# EAGLE design fan (EAGLE 5.12)
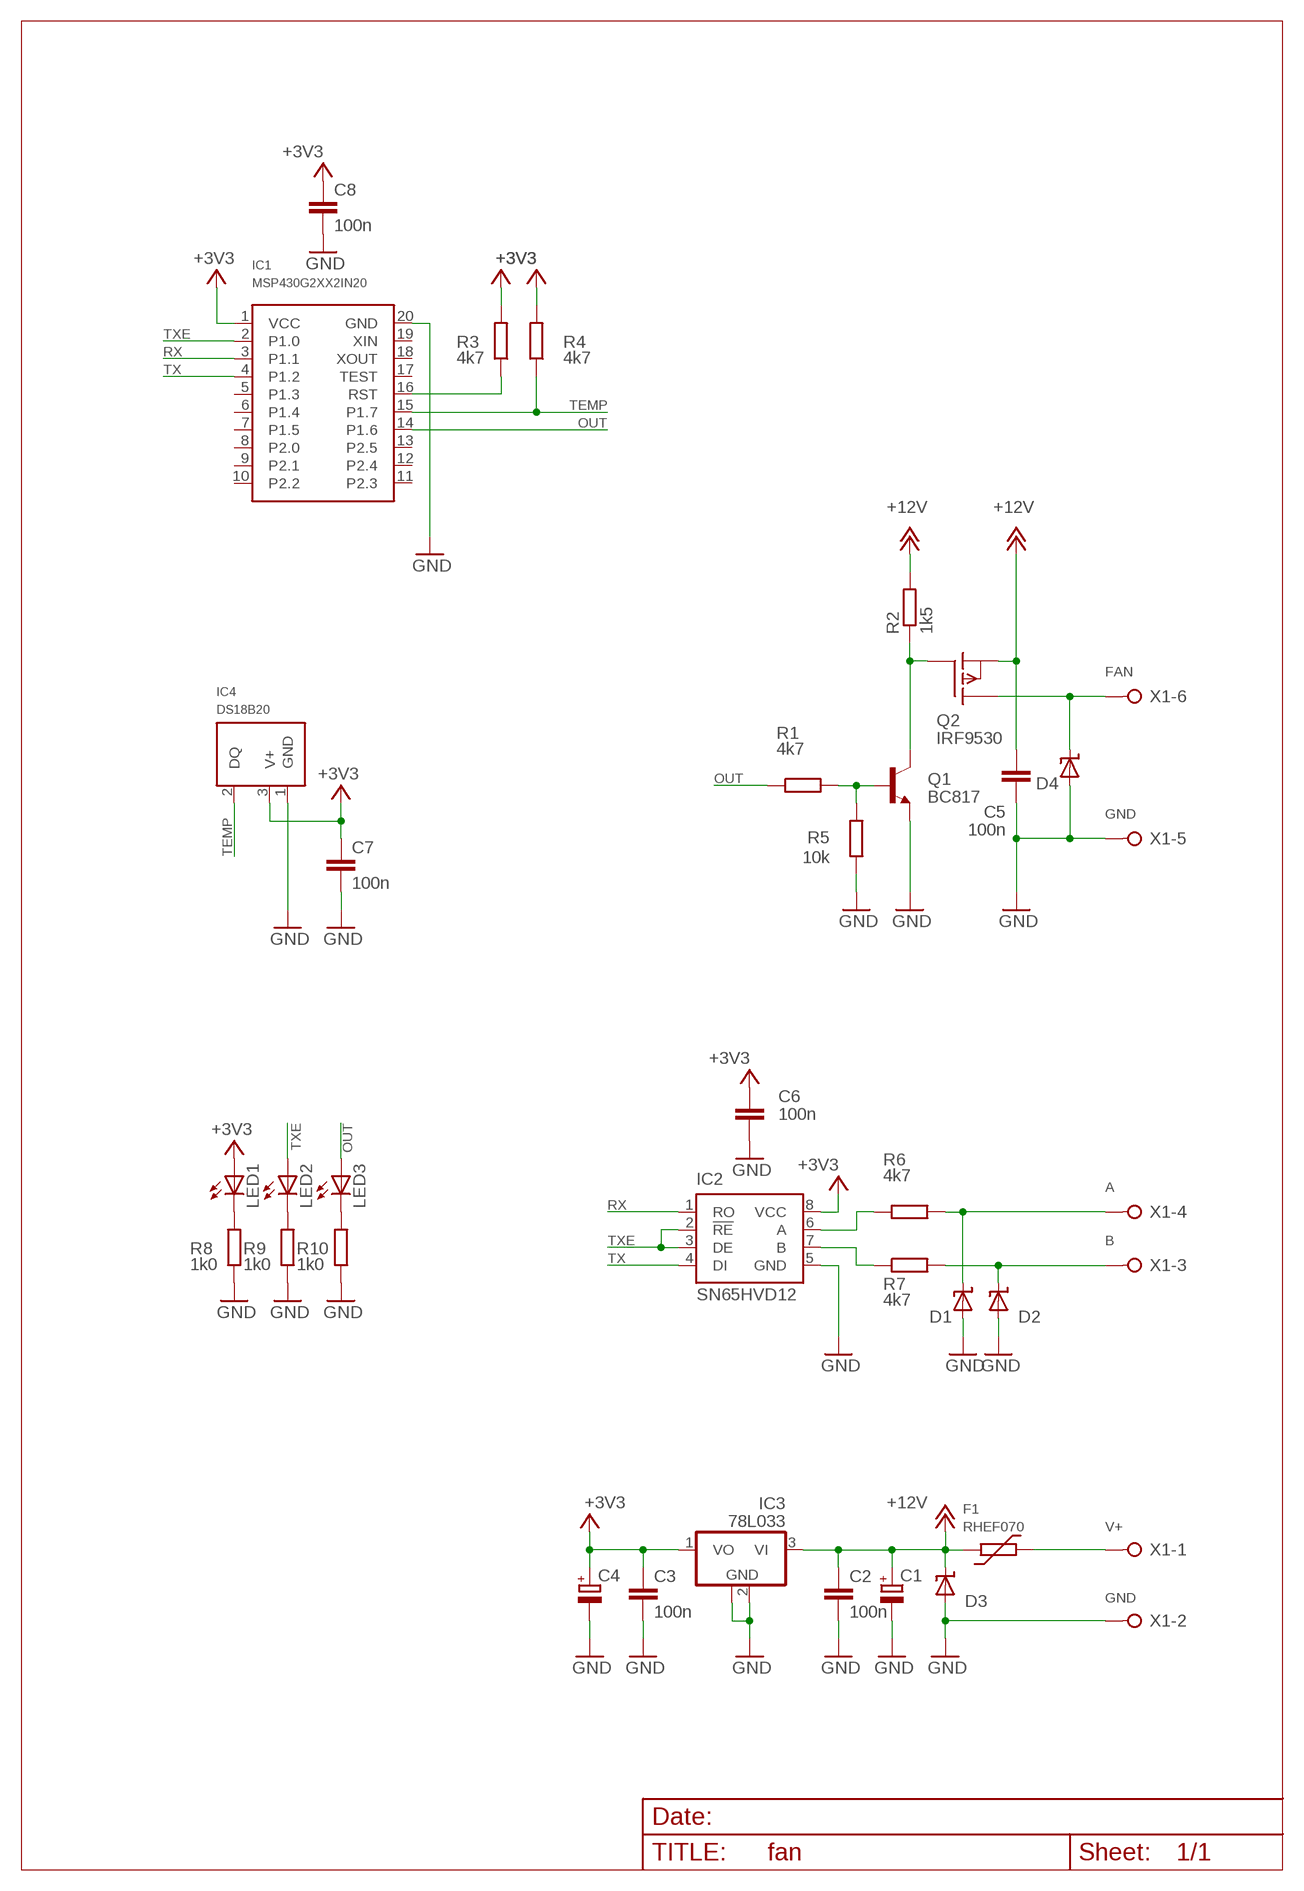
[diagram p0: schematic, sheet 1]

## Parts
C1  CPOL-EUE3.5-8  [E3,5-8]
C2  100n  C-EUC0805  [C0805]
C3  100n  C-EUC0805  [C0805]
C4  CPOL-EUE2.5-7  [E2,5-7]
C5  100n  C-EUC0805  [C0805]
C6  100n  C-EUC0805  [C0805]
C7  100n  C-EUC0805  [C0805]
C8  100n  C-EUC0805  [C0805]
D1  SUPPRESSOR-SMBJ  [SMBJ]
D2  SUPPRESSOR-SMBJ  [SMBJ]
D3  SUPPRESSOR-SMBJ  [SMBJ]
D4  SUPPRESSOR-SMBJ  [SMBJ]
F1  RHEF070  [P7]
IC1  MSP430G2XX2IN20  [DIL20]
IC2  SN65HVD12  LTC485S  [SOIC8]
IC3  78L033  78L05F  [SOT89]
IC4  DS18B20  [TO92]
LED1  LEDSML0805  [SML0805]
LED2  LEDSML0805  [SML0805]
LED3  LEDSML0805  [SML0805]
Q1  BC817  BC817-16LT1SMD  [SOT23-BEC]
Q2  IRF9530  [TO220]
R1  4k7  R-EU_M0805  [M0805]
R2  1k5  R-EU_M0805  [M0805]
R3  4k7  R-EU_M0805  [M0805]
R4  4k7  R-EU_M0805  [M0805]
R5  10k  R-EU_M0805  [M0805]
R6  4k7  R-EU_M1206  [M1206]
R7  4k7  R-EU_M1206  [M1206]
R8  1k0  R-EU_M0805  [M0805]
R9  1k0  R-EU_M0805  [M0805]
R10  1k0  R-EU_M0805  [M0805]
X1  W237-06P  [W237-6P]

## Nets
+3V3: C3.1 C4.+ C6.1 C7.1 C8.1 IC1.1(VCC) IC2.8(VCC) IC3.1(VO) IC4.3(V+) LED1.A R3.2 R4.2
+12V: C1.+ C2.1 C5.1 D3.C F1.P$1 IC3.3(VI) Q2.3(S) R2.2
A: D1.C R6.2 X1.4
B: D2.C R7.2 X1.3
FAN: D4.C Q2.2(D) X1.6
GND: C1.- C2.2 C3.2 C4.- C5.2 C6.2 C7.2 C8.2 D1.A D2.A D3.A D4.A IC1.20(GND) IC2.5(GND) IC3.2(GND) IC3.2@1(GND) IC4.1(GND) Q1.E R5.1 R8.1 R9.1 R10.1 X1.2 X1.5
N$1: Q1.C Q2.1(G) R2.1
N$2: IC1.16(RST) R3.1
N$3: Q1.B R1.2 R5.2
N$4: IC2.6(A) R6.1
N$5: IC2.7(B) R7.1
N$7: LED1.C R8.2
N$8: LED2.C R9.2
N$9: LED3.C R10.2
OUT: IC1.14(P1.6) LED3.A R1.1
RX: IC1.3(P1.1) IC2.1(RO)
TEMP: IC1.15(P1.7) IC4.2(DQ) R4.1
TX: IC1.4(P1.2) IC2.4(DI)
TXE: IC1.2(P1.0) IC2.2(!RE) IC2.3(DE) LED2.A
V+: F1.P$2 X1.1
Unconnected: IC1.5(P1.3) IC1.6(P1.4) IC1.7(P1.5) IC1.8(P2.0) IC1.9(P2.1) IC1.10(P2.2) IC1.11(P2.3) IC1.12(P2.4) IC1.13(P2.5) IC1.17(TEST) IC1.18(XOUT) IC1.19(XIN)

## Library data of the parts
C1 C4 = rcl:CPOL-EU: POLARIZED CAPACITOR, European symbol
C2 C3 C5-C8 = rcl:C-EU: CAPACITOR, European symbol
D1-D4 = MYdiode:SUPPRESSOR-: Suppressor diode
F1 = polyswitch:RHEF070
IC1 = MYtexas:MSP430G2XX2IN20
IC2 = linear-technology:LTC485: Low Power RS485 Interface Transceiver Source: http://www.linear.com/pc/downloadDocument.do?navId=H0,C1,C1007,C1017,P2064,D1718; OC_FARNELL: unknown; OC_NEWARK: unknown
IC3 = MYlinear:78L*: POSITOIV-VOLTAGE REGULATORS Output up to 100 mA Source: http://focus.ti.com/lit/ds/symlink/ua78l05.pdf
IC4 = dallas:DS18B20
LED1-LED3 = led:LED: LED OSRAM: - CHIPLED LG R971, LG N971, LY N971, LG Q971, LY Q971, LO R971, LY R971 LH N974, LH R974 LS Q976, LO Q976, LY Q976 LO Q996 - Hyper CHIPLED LW Q18S LB Q993, LB Q99A, LB R99A - SideLED LS A670, LO A670, LY A670, LG A670, LP A670 LB A673, LV A673, LT A673, LW A673 LH A674 LY A675 LS A676, LA A676, LO A676, LY A676, LW A676 LS A679, LY A679, LG A679 - Hyper Micro SIDELED® LS Y876, LA Y876, LO Y876, LY Y876 LT Y87S - SmartLED LW L88C, LW L88S LB L89C, LB L89S, LG L890 LS L89K, LO L89K, LY L89K LS L896, LA L896, LO L896, LY L896 - TOPLED LS T670, LO T670, LY T670, LG T670, LP T670 LSG T670, LSP T670, LSY T670, LOP T670, LYG T670 LG T671, LOG T671, LSG T671 LB T673, LV T673, LT T673, LW T673 LH T674 LS T676, LA T676, LO T676, LY T676, LB T676, LH T676, LSB T676, LW T676 LB T67C, LV T67C, LT T67C, LS T67K, LO T67K, LY T67K, LW E67C LS E67B, LA E67B, LO E67B, LY E67B, LB E67C, LV E67C, LT E67C LW T67C LS T679, LY T679, LG T679 LS T770, LO T770, LY T770, LG T770, LP T770 LB T773, LV T773, LT T773, LW T773 LH T774 LS E675, LA E675, LY E675, LS T675 LS T776, LA T776, LO T776, LY T776, LB T776 LHGB T686 LT T68C, LB T68C - Hyper Mini TOPLED® LB M676 - Mini TOPLED Santana® LG M470 LS M47K, LO M47K, LY M47K Source: http://www.osram.convergy.de LUXEON: - LUMILED® LXK2-PW12-R00, LXK2-PW12-S00, LXK2-PW14-U00, LXK2-PW14-V00 LXK2-PM12-R00, LXK2-PM12-S00, LXK2-PM14-U00 LXK2-PE12-Q00, LXK2-PE12-R00, LXK2-PE12-S00, LXK2-PE14-T00, LXK2-PE14-U00 LXK2-PB12-K00, LXK2-PB12-L00, LXK2-PB12-M00, LXK2-PB14-N00, LXK2-PB14-P00, LXK2-PB14-Q00 LXK2-PR12-L00, LXK2-PR12-M00, LXK2-PR14-Q00, LXK2-PR14-R00 LXK2-PD12-Q00, LXK2-PD12-R00, LXK2-PD12-S00 LXK2-PH12-R00, LXK2-PH12-S00 LXK2-PL12-P00, LXK2-PL12-Q00, LXK2-PL12-R00 Source: www.luxeon.com KINGBRIGHT: KA-3528ASYC Source: www.kingbright.com
Q1 = transistor-npn:BC817*: NPN Transistor
Q2 = transistor-fet:IRF9530: P-Channel Enhancement MOSFET (HEXFET); -100V; -12A; 0,3Ohm
R1-R10 = rcl:R-EU_: RESISTOR, European symbol
X1 = con-wago-508:W237-06P: WAGO SREW CLAMP; OC_FARNELL: unknown; OC_NEWARK: unknown

## Board
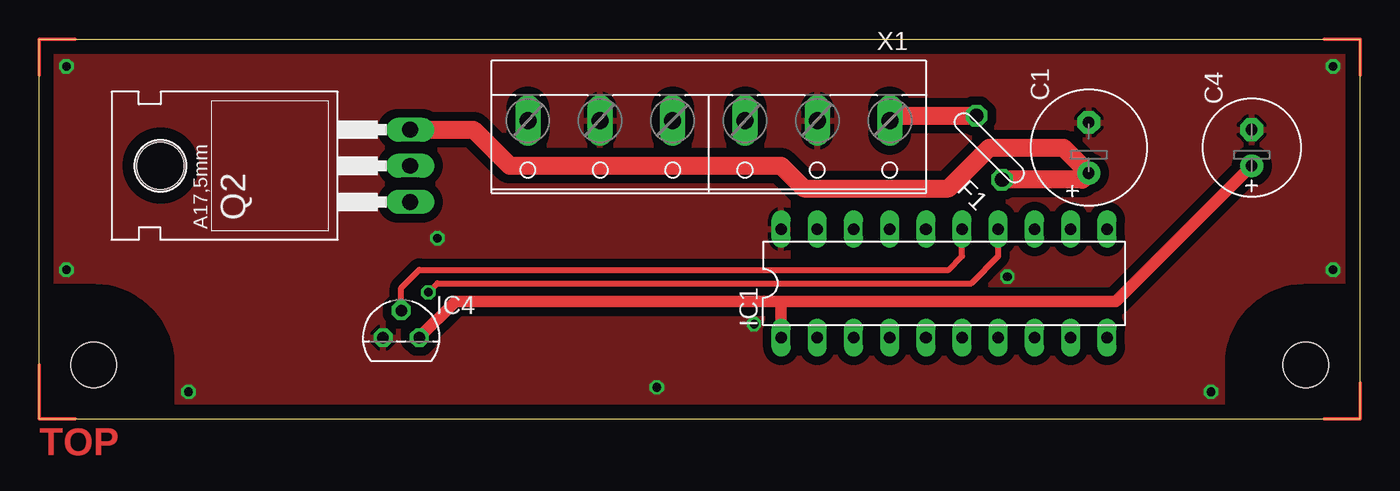
[diagram p1: board, top side]
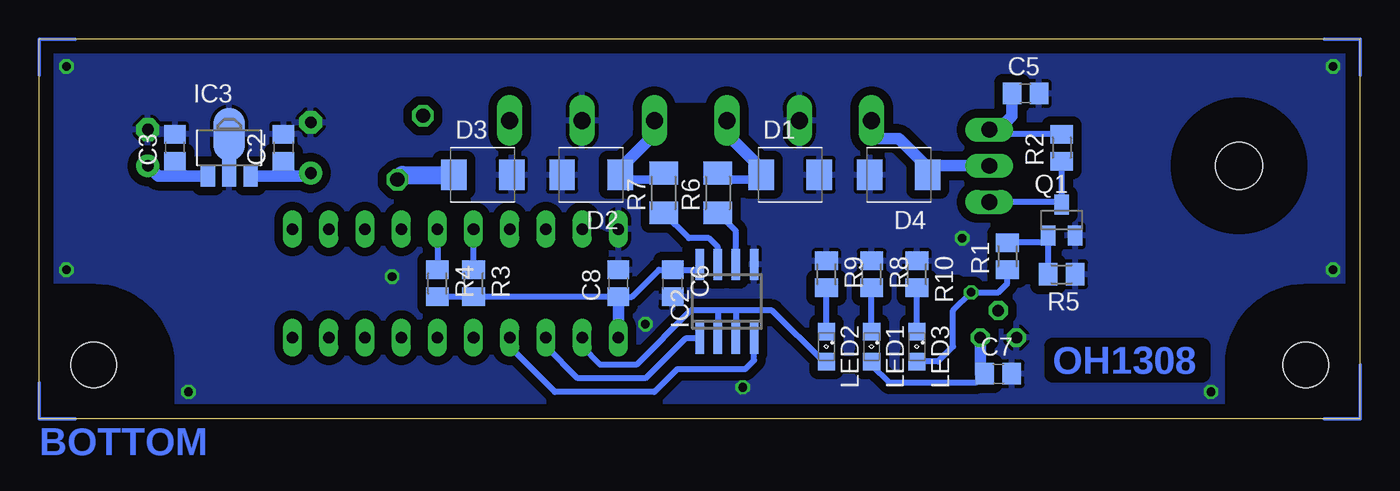
[diagram p2: board, bottom side, seen from below]

Size 92.71 x 26.67 mm. Coordinates in mm from the lower left corner, seen from the top.
Outline: 0,0 92.71,0 92.71,26.67 0,26.67 0,0
Copper layers (1*16): Top 0.035mm / dielectric 1.5mm / Bottom 0.035mm
Design rules "default *": minimum track width 10mil, minimum drill 24mil, track to track 8mil, track to pad 8mil, pad to pad 8mil, via to via 8mil, smd to smd 8mil, copper to edge 40mil, drill to drill 8mil, minimum pad ring 10mil, minimum via ring 8mil, stop-mask expansion 4mil, vias tented up to drill 25mil, thermal gap 10mil
Holes 3.2 mm at 3.81,3.81 88.9,3.81
tRestrict: 7 lines
bRestrict: area 11.1,3.2 to 21.6,5.1; 10 lines

### Footprints (pad centres in the part's own frame; a part is rotated, then mirrored left to right if it is on the bottom)
E3,5-8 = drill 0.813 pad 1.6 round: + -1.778,0 | drill 0.813 pad 1.6 octagon: - 1.778,0
C0805 = smd 1.3 x 1.5: 1 -0.95,0; 2 0.95,0
E2,5-7 = drill 0.813 pad 1.6 round: + -1.27,0 | drill 0.813 pad 1.6 octagon: - 1.27,0
SMBJ = smd 1.78 x 2.16: A 2.04,0; C -2.03,0
P7 = drill 1 octagon: P$1 -2.223,0.953; P$2 2.223,-0.953
DIL20 = drill 0.813 long: 1 -11.43,-3.81; 2 -8.89,-3.81; 3 -6.35,-3.81; 4 -3.81,-3.81; 5 -1.27,-3.81; 6 1.27,-3.81; 7 3.81,-3.81; 8 6.35,-3.81; 9 8.89,-3.81; 10 11.43,-3.81; 11 11.43,3.81; 12 8.89,3.81; 13 6.35,3.81; 14 3.81,3.81; 15 1.27,3.81; 16 -1.27,3.81; 17 -3.81,3.81; 18 -6.35,3.81; 19 -8.89,3.81; 20 -11.43,3.81
SOIC8 = smd 0.6 x 2.2: 1 -1.905,-2.6; 2 -0.635,-2.6; 3 0.635,-2.6; 4 1.905,-2.6; 5 1.905,2.6; 6 0.635,2.6; 7 -0.635,2.6; 8 -1.905,2.6
SOT89 = smd 1 x 1.5: 1 -1.499,-1.981; 3 1.499,-1.981 | smd 1 x 2: 2 0,-1.727 | smd 2.2 x 3.7: 2@1 0,0.94
TO92 = drill 0.813 octagon: 1 -1.27,0; 2 0,1.905; 3 1.27,0
SML0805 = smd 1.2 x 1.2: A 1.05,0; C -1.05,0
SOT23-BEC = smd 1 x 1.4: B -0.95,-1.1; C 0,1.1; E 0.95,-1.1
TO220 = drill 1.118 long: 1 -2.54,-6.35; 2 0,-6.35; 3 2.54,-6.35 | hole 3.302: 0,11.176
M0805 = smd 1.3 x 1.6: 1 -0.95,0; 2 0.95,0
M1206 = smd 1.6 x 2: 1 -1.4,0; 2 1.4,0
W237-6P = drill 1.194 long: 1 -12.7,-0.635; 2 -7.62,-0.635; 3 -2.54,-0.635; 4 2.54,-0.635; 5 7.62,-0.635; 6 12.7,-0.635

### Placement (x,y rotation side)
C1  73.66,19.05 90 top
C2  75.56,19.05 90 bottom
C3  83.19,19.05 90 bottom
C4  85.09,19.05 90 top
C5  23.5,22.86 0 bottom
C6  48.26,9.53 270 bottom
C7  25.4,3.17 0 bottom
C8  52.07,9.53 90 bottom
D1  40.01,17.14 0 bottom
D2  53.98,17.14 180 bottom
D3  61.59,17.14 0 bottom
D4  32.38,17.14 180 bottom
F1  66.67,19.05 135 top
IC1  63.5,9.53 0 top
IC2  44.45,8.26 0 bottom
IC3  79.38,19.05 0 bottom
IC4  25.4,5.71 0 top
LED1  34.29,5.08 270 bottom
LED2  37.47,5.08 270 bottom
LED3  31.11,5.08 270 bottom
Q1  20.95,13.97 0 bottom
Q2  19.68,17.78 90 top
R1  24.77,11.43 90 bottom
R2  20.95,19.05 90 bottom
R3  62.23,9.53 270 bottom
R4  64.77,9.53 270 bottom
R5  20.95,10.16 180 bottom
R6  45.09,15.88 90 bottom
R7  48.9,15.88 90 bottom
R8  34.29,10.16 270 bottom
R9  37.47,10.16 270 bottom
R10  31.11,10.16 270 bottom
X1  46.99,20.32 180 top

### Tracks (layer width: path | path; a pad name or v marks a point on that pad's centre or on a via)
+3V3
  Top 0.813: C4.+ 75.56,8.26 52.07,8.26 | 52.07,8.26 IC1.1 | IC4.3 29.21,8.26 52.07,8.26
  Bottom 0.406: IC2.8 46.42,10.47 C6.1 49.22,10.47 51.12,8.57 C8.1 R3.2 R4.2 | LED1.A 34.29,3.81 33.02,2.54 26.98,2.54 C7.1
  Bottom 0.813: C7.1 26.67,3.17 IC4.3 | IC1.1 C8.1 | 82.55,17.07 84.38,17.07 C4.+ | 82.55,17.07 IC3.1 | C3.1 83.19,17.7 82.55,17.07
+12V
  Top 1.27: Q2.3 30.48,20.32 33.02,17.78 52.07,17.78 53.66,16.19 63.82,16.19 66.67,19.05 71.88,19.05 C1.+ 73.19,16.8 F1.P$1
  Bottom 0.406: R2.2 25.71,20 Q2.3
  Bottom 0.813: C5.1 24.45,21.27 25.4,20.32 Q2.3 | 74.93,17.07 73.86,17.07 C1.+ | 74.93,17.07 IC3.3 | C2.1 75.56,17.7 74.93,17.07
  Bottom 1.27: D3.C 67.23,17.14 F1.P$1
A
  Bottom 0.61: R6.2 44.32,16.83 42.03,16.83 D1.C
  Bottom 0.813: X1.4 44.45,20 42.23,17.78 41.91,17.78 D1.C
B
  Bottom 0.61: R7.2 48.9,17.14 49.21,16.83 52.26,16.83 D2.C
  Bottom 0.813: X1.3 49.53,20 51.75,17.78 52.07,17.78 D2.C
FAN
  Bottom 0.61: D4.C 30.48,17.14 30.48,17.78
  Bottom 0.813: Q2.2 30.48,17.78 32.38,19.68 34.29,19.68 X1.6
GND  (via drill 0.6)
  other vias: 43.34,2.22 10.48,1.91 82.23,1.91 90.81,10.48 1.91,10.48 1.91,24.77 90.81,24.77 27.94,12.7 50.16,6.67 67.94,10
  pour Bottom (isolate 0.61): 0,26.67 0,0 92.71,0 92.71,26.67
  pour Top (isolate 0.61): 0,26.67 0,0 92.71,0 92.71,26.67
N$1
  Bottom 0.406: R2.1 Q1.C 21.12,15.24 Q2.1
N$2
  Bottom 0.406: R3.1 IC1.16
N$3
  Bottom 0.406: R5.2 Q1.B 21.76,12.38 R1.2
N$4
  Bottom 0.406: R6.1 43.81,13.21 IC2.6
N$5
  Bottom 0.406: R7.1 47.12,12.7 45.72,12.7 45.09,12.06 IC2.7
N$6
  Top 0.254: 0,3.81 0,0 2.54,0
N$7
  Bottom 0.406: LED1.C R8.2
N$8
  Bottom 0.406: LED2.C R9.2
N$9
  Bottom 0.406: LED3.C R10.2
N$10
  Top 0.254: 0,24.13 0,26.67 2.54,26.67
N$11
  Top 0.254: 90.17,26.67 92.71,26.67 92.71,24.13
N$12
  Top 0.254: 92.71,2.54 92.71,0 90.17,0
N$13
  Bottom 0.254: 2.54,0 0,0 0,3.81
N$14
  Bottom 0.254: 0,24.13 0,26.67 2.54,26.67
N$15
  Bottom 0.254: 90.17,26.67 92.71,26.67 92.71,24.13
N$16
  Bottom 0.254: 92.71,2.54 92.71,0 90.17,0
OUT  (via drill 0.6)
  Top 0.406: v27.3,8.89 27.94,9.53 65.41,9.53 67.31,11.43 IC1.14
  Bottom 0.406: R1.1 24.77,9.53 25.4,8.89 v27.3,8.89 28.57,7.62 28.57,5.08 29.62,4.03 LED3.A
RX
  Bottom 0.406: IC1.3 57.15,5.08 54.93,2.86 50.16,2.86 47.37,5.66 IC2.1
TEMP
  Top 0.406: IC1.15 64.77,11.43 63.82,10.48 26.67,10.48 25.4,9.21 IC4.2
  Bottom 0.406: IC1.15 R4.1
TX
  Bottom 0.406: IC1.4 59.69,5.08 56.52,1.91 49.53,1.91 47.94,3.49 43.18,3.49 42.55,4.13 IC2.4
TXE
  Bottom 0.406: IC1.2 54.61,5.08 53.34,3.81 50.8,3.81 46.99,7.62 45.09,7.62 | 43.81,7.62 45.09,7.62 | 43.81,7.62 IC2.3 | 45.09,7.62 IC2.2 | LED2.A 37.69,4.03 41.27,7.62 43.81,7.62
V+
  Top 1.27: F1.P$2 59.69,21.3 X1.1

### Text on the board
Top: TOP
Bottom: OH1308 | BOTTOM
Dimension: DIMENSION
tStop: TOP_SOLDER_STOP
bStop: BOTTOM_SOLDER_STOP
Measures: 92.7 | 26.7 | 85.1
Reference: O+ | O- | A | B | - | + | Q2 | + | + | IC4 | IC1 | OH1308 | https://github.com/ondrejh/msp430fan | TOP_SILKSCREEN